# EAGLE schematic R2Quad Power Distribution Board (EAGLE 7.3.0)
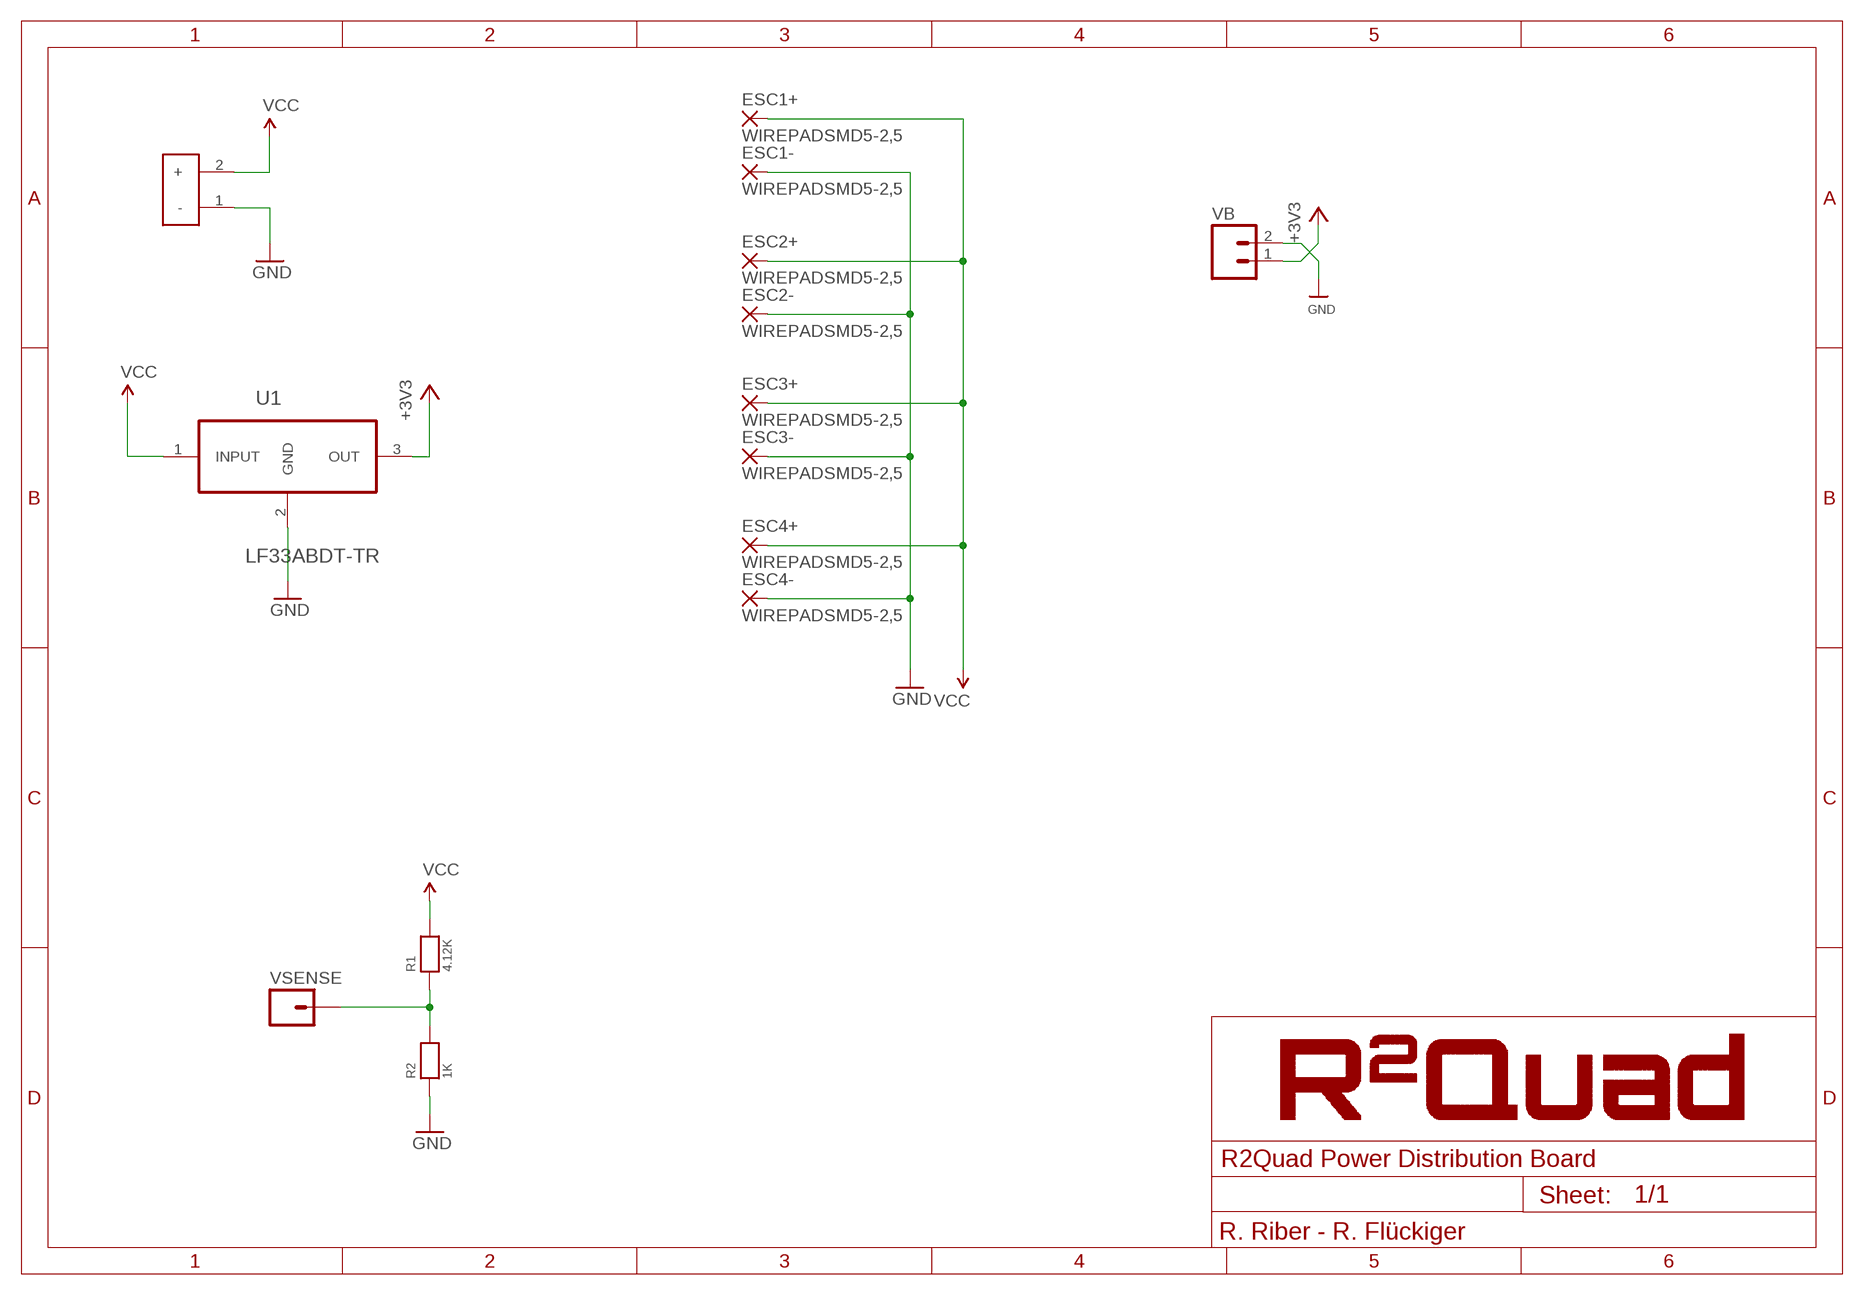
[diagram p0: schematic, sheet 1]

## Parts
ESC1+  WIREPADSMD5-2,5  [5-2,5]
ESC1-  WIREPADSMD5-2,5  [5-2,5]
ESC2+  WIREPADSMD5-2,5  [5-2,5]
ESC2-  WIREPADSMD5-2,5  [5-2,5]
ESC3+  WIREPADSMD5-2,5  [5-2,5]
ESC3-  WIREPADSMD5-2,5  [5-2,5]
ESC4+  WIREPADSMD5-2,5  [5-2,5]
ESC4-  WIREPADSMD5-2,5  [5-2,5]
R1  4.12K  RESISTOR0603  [0603]
R2  1K  RESISTOR0603  [0603]
U1  LF33ABDT-TR  [TO228P972X240-3N]
U$1  XT60  [XT60]
VB  M02PTH  [1X02]
VSENSE  M01PTH  [1X01]

## Nets
+3V3: U1.3(OUT) VB.1
GND: ESC1-.1(P) ESC2-.1(P) ESC3-.1(P) ESC4-.1(P) R2.1 U1.2(GND) U$1.1(-) VB.2
N$1: R1.1 R2.2 VSENSE.1
VCC: ESC1+.1(P) ESC2+.1(P) ESC3+.1(P) ESC4+.1(P) R1.2 U1.1(INPUT) U$1.2(+)

## Notes on the sheet
- R. Riber - R. Flückiger

## Library data of the parts
ESC1+ ESC1- ESC2+ ESC2- ESC3+ ESC3- ESC4+ ESC4- = wirepad:WIREPAD: Wire PAD connect wire on PCB
R1 R2 = microbuilder:RESISTOR: Resistors 0402 - 0402 Surface Mount Package 22 Ohm 1% 1/16W [Digikey: 311-22.0LRTR-ND] 33 Ohm 5% 1/16W 1.0K 5% 1/16W 1.5K 5% 1/16W 2.0K 1% 1/16W 10.0K 1% 1/16W [Digikey: 311-10.0KLRTR-ND] 10.0K 5% 1/16W [Digikey: RMCF0402JT10K0TR-ND] 12.1K 1% 1/16W [Digikey: 311-22.0LRTR-ND] 100.0K 5% 1/16W 0603 - 0603 Surface Mount Package 0 Ohm 1/10 Watt 1% Resistor 15 Ohm 1/10 Watt 1% Resistor 33 Ohm 1/10 Watt 1% Resistor 49.9 Ohm 1/10 Watt 1% Resistor 100 Ohm 1/10 Watt 1% Resistor 150 Ohm 1/10 Watt 1% Resistor 240 Ohm 1/10 Watt 1% Resistor 390 Ohm 1/10 Watt 1% Resistor 560 Ohm 1/10 Watt 1% Resistor 680 Ohm 1/10 Watt 1% Resistor 750 Ohm 1/10 Watt 1% Resistor 1.0K Ohm 1/10 Watt 1% Resistor 1.5K Ohm 1/10 Watt 1% Resistor 2.0K Ohm 1/10 Watt 1% Resistor 2.2K Ohm 1/10 Watt 1% Resistor 3.3K Ohm 1/10 Watt 1% Resistor 4.7K Ohm 1/10 Watt 1% Resistor 10.0K Ohm 1/10 Watt 1% Resistor 12.0K Ohm 1/10 Watt 1% Resistor 12.1K Ohm 1/10 Watt 1% Resistor 20.0K Ohm 1/10 Watt 1% Resistor 33.0K Ohm 1/10 Watt 1% Resistor 100.0K Ohm 1/10 Watt 1% Resistor 0805 - 0805 Surface Mount Package 0 Ohm 1/8 Watt 1% Resistor 33 Ohm 1/8 Watt 1% Resistor 100 Ohm 1/8 Watt 1% Resistor 150 Ohm 1/8 Watt 1% Resistor 200 Ohm 1/8 Watt 1% Resistor 240 Ohm 1/8 Watt 1% Resistor 330 Ohm 1/8 Watt 1% Resistor 390 Ohm 1/8 Watt 1% Resistor 470 Ohm 1/8 Watt 1% Resistor 1.0K Ohm 1/8 Watt 1% Resistor 1.5K Ohm 1/8 Watt 1% Resistor 2.0K Ohm 1/8 Watt 1% Resistor 4.7K Ohm 1/8 Watt 1% Resistor 5.1K Ohm 1/8 Watt 1% Resistor 5.6K Ohm 1/8 Watt 1% Resistor 10.0K Ohm 1/8 Watt 1% Resistor 22.0K Ohm 1/8 Watt 1% Resistor 33.0K Ohm 1/8 Watt 1% Resistor 100K Ohm 1/8 Watt 1% Resistor 1206 - 1206 Surface Mount Package 2012 - 2010 Surface Mount Package 0.11 Ohm 1/2 Watt 1% Resistor - Digikey: RHM.11UCT-ND
U1 = LF33ABDT-TR:LF33ABDT-TR: LDO, 0.45VDO, 1A, 3.3V, 1%, 3TO252; AVAILABILITY: Good; DESCRIPTION: LF33 Series 3.3 V 500 mA Very Low Drop Voltage Regulator with Inhibit - TO-252; MF: STMicroelectronics; MP: LF33ABDT-TR; PACKAGE: None; PRICE: 0.43 USD
U$1 = Rafael's Library:XT60
VB = SparkFun-Connectors:M02: Standard 2-pin 0.1" header. Use with - straight break away headers ( PRT-00116) - right angle break away headers (PRT-00553) - swiss pins (PRT-00743) - machine pins (PRT-00117) - female headers (PRT-00115) Molex polarized connector foot print use with: PRT-08233 with associated crimp pins and housings. 2.54_SCREWTERM for use with PRT-10571. 3.5mm Screw Terminal footprints for PRT-08084 5mm Screw Terminal footprints for use with PRT-08432
VSENSE = SparkFun-Connectors:M01: Header 1 Standard 1-pin 0.1" header. Use with straight break away headers (SKU : PRT-00116), right angle break away headers (PRT-00553), swiss pins (PRT-00743), machine pins (PRT-00117), and female headers (PRT-00115). SMTSO-256-ET is a "flush mount" nut for a 4-40 screw. The older package used to be too tight, and did not allow it to sit properly thru the drill hit. The latest (0.165DIA) fits nice and snug.